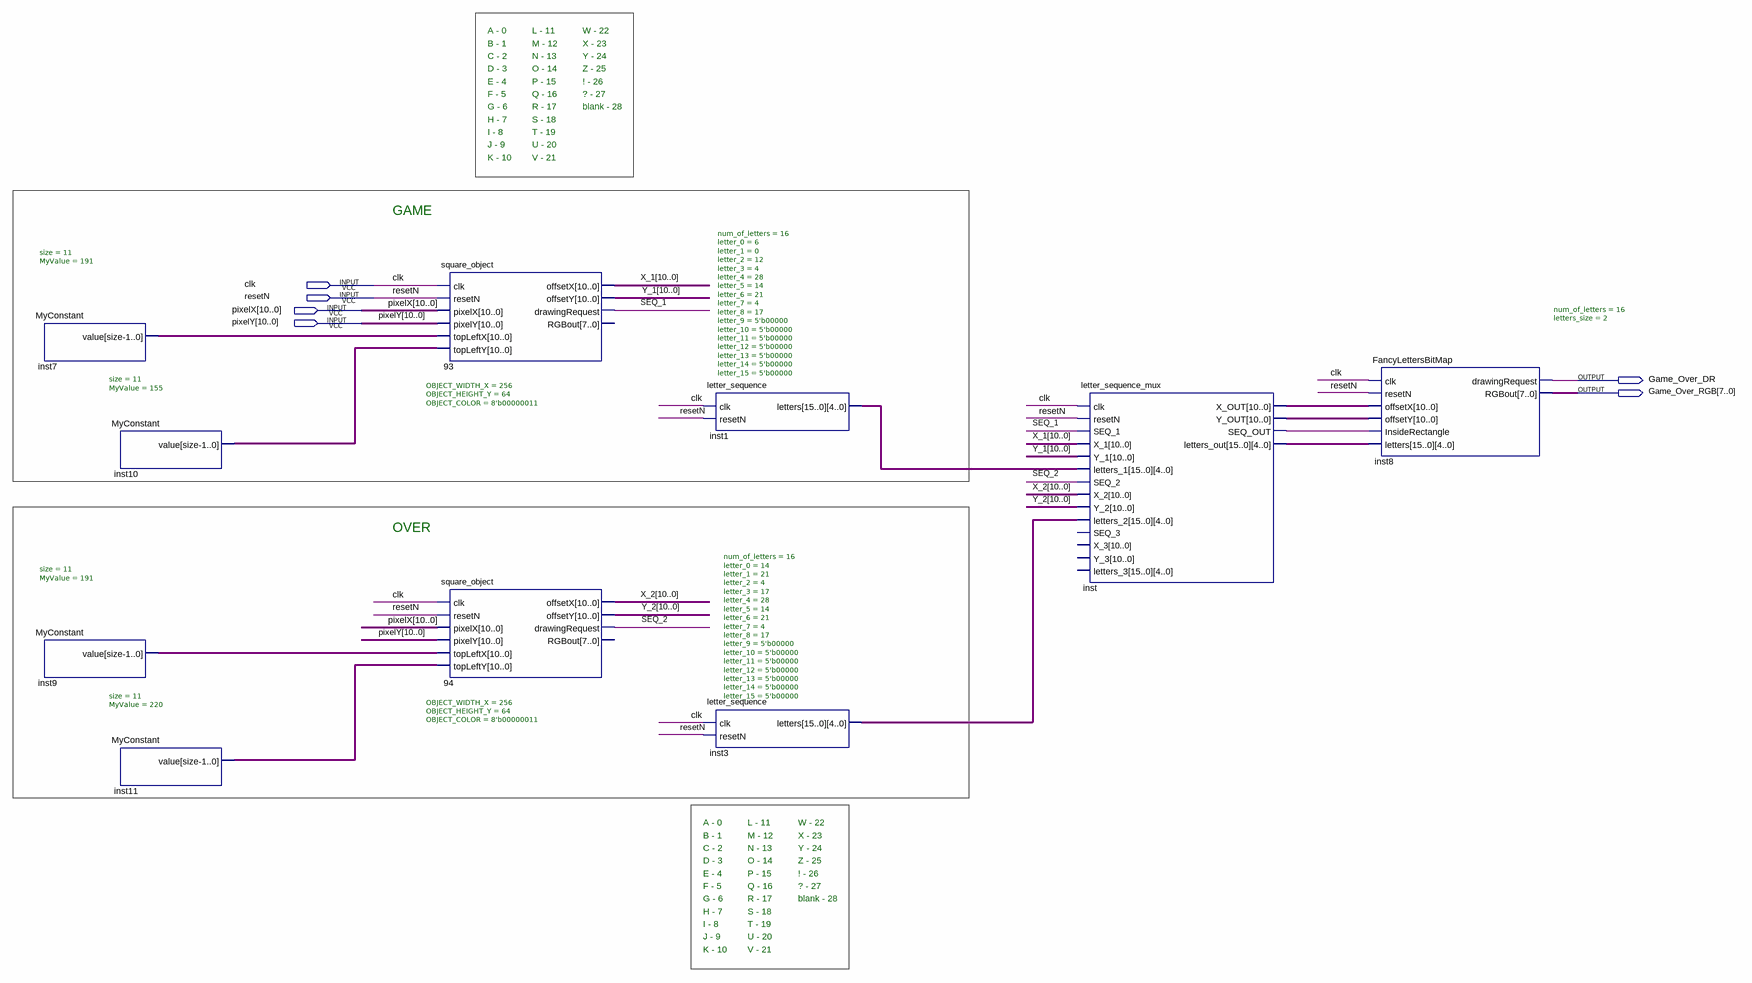
[diagram p0: schematic sheet]
// Quartus schematic Game_Over_Screen_Block.bdf as structural Verilog: 10 symbols, 6 pins
module Game_Over_Screen_Block (
  input  clk,
  input  resetN,
  input  [10:0] pixelX,
  input  [10:0] pixelY,
  output Game_Over_DR,
  output [7:0] Game_Over_RGB
);

  wire inst_seq_out, SEQ_1, SEQ_2;
  wire [10:0] inst7_value, inst9_value, inst10_value, inst11_value, inst_x_out, inst_y_out, X_1, X_2, Y_1,
       Y_2;
  wire [79:0] inst1_letters, inst3_letters, inst_letters_out;

  MyConstant #(.size(11), .MyValue(191)) inst7 (.value(inst7_value));
  MyConstant #(.size(11), .MyValue(191)) inst9 (.value(inst9_value));
  MyConstant #(.size(11), .MyValue(155)) inst10 (.value(inst10_value));
  MyConstant #(.size(11), .MyValue(220)) inst11 (.value(inst11_value));
  square_object #(.OBJECT_WIDTH_X(256), .OBJECT_HEIGHT_Y(64), .OBJECT_COLOR(8'b00000011)) u_93 (
    .clk(clk), .resetN(resetN), .pixelX(pixelX), .pixelY(pixelY), .topLeftX(inst7_value),
    .topLeftY(inst10_value), .offsetX(X_1), .offsetY(Y_1), .drawingRequest(SEQ_1));  // open: RGBout
  square_object #(.OBJECT_WIDTH_X(256), .OBJECT_HEIGHT_Y(64), .OBJECT_COLOR(8'b00000011)) u_94 (
    .clk(clk), .resetN(resetN), .pixelX(pixelX), .pixelY(pixelY), .topLeftX(inst9_value),
    .topLeftY(inst11_value), .offsetX(X_2), .offsetY(Y_2), .drawingRequest(SEQ_2));  // open: RGBout
  letter_sequence #(.num_of_letters(16), .letter_0(6), .letter_1(0), .letter_2(12), .letter_3(4), .letter_4(28), .letter_5(14), .letter_6(21), .letter_7(4), .letter_8(17), .letter_9(5'b00000), .letter_10(5'b00000), .letter_11(5'b00000), .letter_12(5'b00000), .letter_13(5'b00000), .letter_14(5'b00000), .letter_15(5'b00000)) inst1 (
    .clk(clk), .resetN(resetN), .letters(inst1_letters));
  letter_sequence #(.num_of_letters(16), .letter_0(14), .letter_1(21), .letter_2(4), .letter_3(17), .letter_4(28), .letter_5(14), .letter_6(21), .letter_7(4), .letter_8(17), .letter_9(5'b00000), .letter_10(5'b00000), .letter_11(5'b00000), .letter_12(5'b00000), .letter_13(5'b00000), .letter_14(5'b00000), .letter_15(5'b00000)) inst3 (
    .clk(clk), .resetN(resetN), .letters(inst3_letters));
  letter_sequence_mux inst (
    .clk(clk), .resetN(resetN), .SEQ_1(SEQ_1), .X_1(X_1), .Y_1(Y_1), .letters_1(inst1_letters),
    .SEQ_2(SEQ_2), .X_2(X_2), .Y_2(Y_2), .letters_2(inst3_letters), .X_OUT(inst_x_out), .Y_OUT(inst_y_out),
    .SEQ_OUT(inst_seq_out), .letters_out(inst_letters_out));  // open: SEQ_3, X_3, Y_3, letters_3
  FancyLettersBitMap #(.num_of_letters(16), .letters_size(2)) inst8 (
    .clk(clk), .resetN(resetN), .offsetX(inst_x_out), .offsetY(inst_y_out), .InsideRectangle(inst_seq_out),
    .letters(inst_letters_out), .drawingRequest(Game_Over_DR), .RGBout(Game_Over_RGB));

  // Notes on the sheet:
  //   A - 0
  //   L - 11
  //   W - 22
  //   B - 1
  //   M - 12
  //   X - 23
  //   C - 2
  //   N - 13
  //   Y - 24
  //   D - 3
  //   O - 14
  //   Z - 25
  //   E - 4
  //   P - 15
  //   ! - 26
  //   F - 5
  //   Q - 16
  //   ? - 27
  //   G - 6
  //   R - 17
  //   blank - 28
  //   H - 7
  //   S - 18
  //   I - 8
  //   T - 19
  //   J - 9
  //   U - 20
  //   K - 10
  //   V - 21
  //   GAME
  //   OVER
  //   A - 0
  //   L - 11
  //   W - 22
  //   B - 1
  //   M - 12
  //   X - 23
  //   C - 2
  //   N - 13
  //   Y - 24
  //   D - 3
  //   O - 14
  //   Z - 25
  //   E - 4
  //   P - 15
  //   ! - 26
  //   F - 5
  //   Q - 16
  //   ? - 27
  //   G - 6
  //   R - 17
  //   blank - 28
  //   H - 7
  //   S - 18
  //   I - 8
  //   T - 19
  //   J - 9
  //   U - 20
  //   K - 10
  //   V - 21
endmodule
